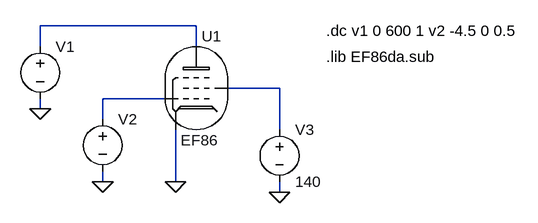
[diagram p0: schematic EF86da.asc]
EF86da.asc, the LTspice schematic file:
Version 4
SHEET 1 1020 680
WIRE 496 208 256 208
WIRE 256 240 256 208
WIRE 496 240 496 208
WIRE 624 304 544 304
WIRE 448 320 352 320
WIRE 256 336 256 320
WIRE 352 352 352 320
WIRE 624 368 624 304
WIRE 352 448 352 432
WIRE 464 448 464 368
WIRE 624 464 624 448
FLAG 624 464 0
FLAG 256 336 0
FLAG 464 448 0
FLAG 352 448 0
SYMBOL voltage 256 224 R0
SYMATTR InstName V1
SYMATTR Value ""
SYMBOL voltage 352 336 R0
SYMATTR InstName V2
SYMATTR Value ""
SYMBOL voltage 624 352 R0
SYMATTR InstName V3
SYMATTR Value 140
SYMBOL EF86da 496 304 R0
SYMATTR InstName U1
TEXT 696 256 Left 2 !.lib EF86da.sub
TEXT 696 216 Left 2 !.dc v1 0 600 1 v2 -4.5 0 0.5

The netlist it stands for:
* EF86da.asc
V1 N001 0
V2 N003 0
V3 N002 0 140
XU1 N001 N002 N003 0 EF86da  ; pins Anode Screen Grid Cathode
.lib EF86da.sub
.dc v1 0 600 1 v2 -4.5 0 0.5
.lib EF86da.sub
.backanno
.end